# EAGLE design Qwiic PL-N823 IR Breakout (EAGLE 9.4.2)
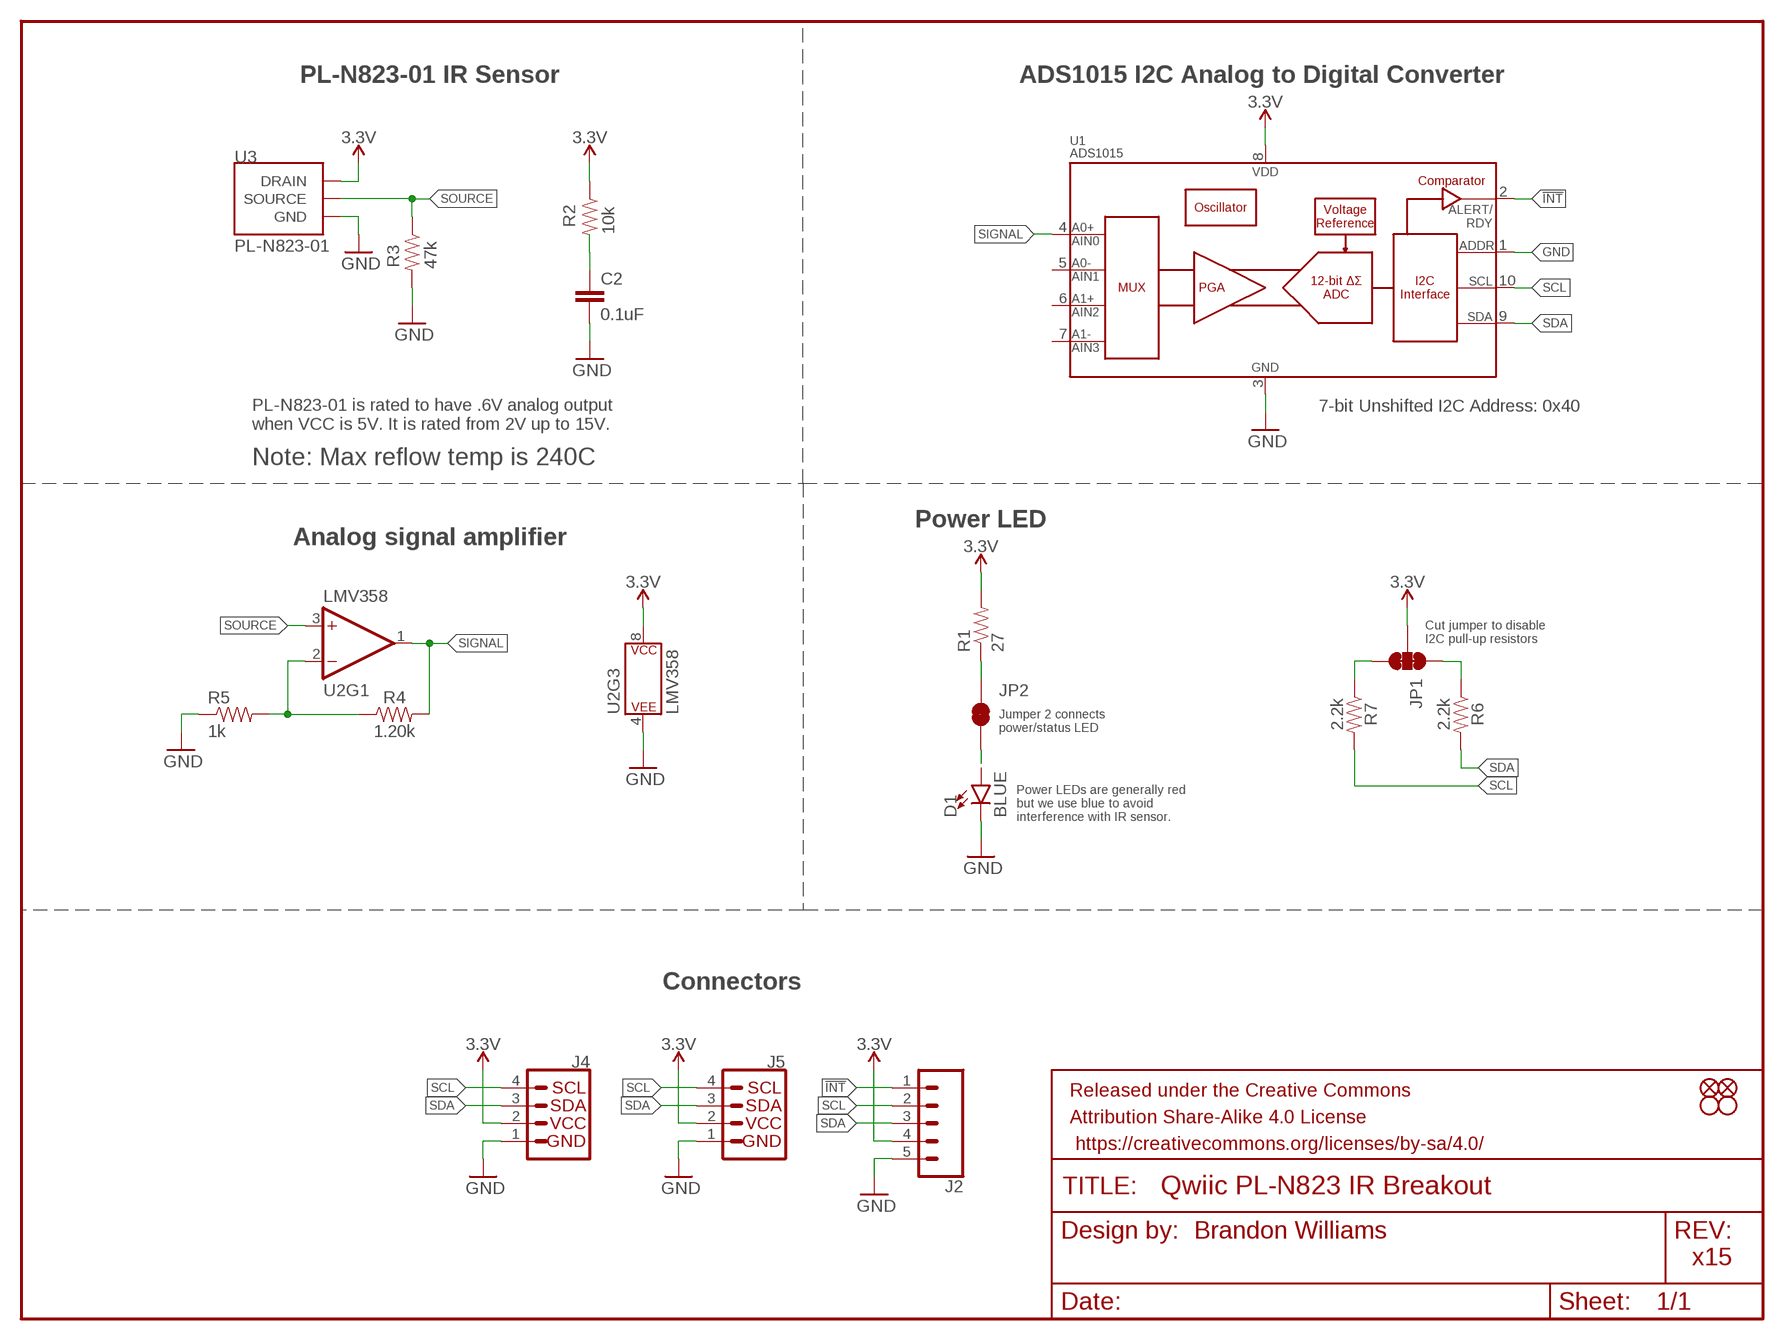
[diagram p0: schematic, sheet 1]

## Parts
C2  0.1uF  0.1UF-0603-25V-(+80/-20%)  [0603]
D1  BLUE  LED-BLUE0603  [LED-0603]
FD1  FIDUCIALUFIDUCIAL  [FIDUCIAL-MICRO]
FD2  FIDUCIALUFIDUCIAL  [FIDUCIAL-MICRO]
FRAME1  FRAME-LETTERNO_PACKAGE  [DUMMY]
H1  STAND-OFFTIGHT  [STAND-OFF-TIGHT]
H2  STAND-OFFTIGHT  [STAND-OFF-TIGHT]
J2  CONN_05NO_SILK  [1X05_NO_SILK]
J4  QWIIC_CONNECTORJS-1MM  [JST04_1MM_RA]
J5  QWIIC_CONNECTORJS-1MM  [JST04_1MM_RA]
JP1  JUMPER-SMT_3_2-NC_TRACE_SILK  [SMT-JUMPER_3_2-NC_TRACE_SILK]
JP2  JUMPER-SMT_2_NC_TRACE_SILK  [SMT-JUMPER_2_NC_TRACE_SILK]
R1  27  27OHM-0603-1/10W-1%  [0603]
R2  10k  10KOHM-0603-1/10W-1%  [0603]
R3  47k  47KOHM-0603-1/10W-1%  [0603]
R4  1.20k  1.20KOHM-0603-1/10W-1%  [0603]
R5  1k  1KOHM-0603-1/10W-1%  [0603]
R6  2.2k  2.2KOHM-0603-1/10W-1%  [0603]
R7  2.2k  2.2KOHM-0603-1/10W-1%  [0603]
U1  ADS1015  [MSOP10]
U2  LMV358  LMV358SOIC  [SO08]
U3  PL-N823-01  [PL-N823-01]

## Nets
3.3V: J2.4 J4.2 J5.2 JP1.2 R1.2 R2.1 U1.8(VDD) U2.8(P$V+) U3.DRAIN
!INT: J2.1 U1.2(ALERT/RDY)
GND: C2.2 D1.C J2.5 J4.1 J5.1 R3.2 R5.1 U1.1(ADDR) U1.3(VSS) U2.4(P$V-) U3.GND@1(GND) U3.GND@2(GND)
N$1: R4.1 R5.2 U2.2(-IN)
N$2: C2.1 R2.2
N$3: JP2.1 R1.1
N$4: JP1.3 R7.1
N$5: JP1.1 R6.1
N$6: D1.A JP2.2
SCL: J2.2 J4.4 J5.4 R7.2 U1.10(SCL)
SDA: J2.3 J4.3 J5.3 R6.2 U1.9(SDA)
SIGNAL: R4.2 U1.4(AIN0) U2.1(OUT)
SOURCE: R3.1 U2.3(+IN) U3.SOURCE
Unconnected: U1.5(AIN1) U1.6(AIN2) U1.7(AIN3) U2.5(+IN) U2.6(-IN) U2.7(OUT)

## Notes on the sheet
- PL-N823-01 IR Sensor | ADS1015 I2C Analog to Digital Converter
- 7-bit Unshifted I2C Address: 0x40
- PL-N823-01 is rated to have .6V analog output
  when VCC is 5V. It is rated from 2V up to 15V.
- Note: Max reflow temp is 240C
- Power LED
- Analog signal amplifier
- Cut jumper to disable
  I2C pull-up resistors
- Jumper 2 connects 
  power/status LED
- Power LEDs are generally red
  but we use blue to avoid
  interference with IR sensor.
- Connectors
- Brandon Williams
- x15

## Library data of the parts
C2 = SparkFun-Capacitors:0.1UF: 0.1µF ceramic capacitors A capacitor is a passive two-terminal electrical component used to store electrical energy temporarily in an electric field.; PROD_ID: CAP-00810
D1 = SparkFun-LED:LED-BLUE: Blue SMD LED Used in manufacturing of various products at SparkFun Packages: 0603 - SMD 0603 package [Product Link] <http://www.digikey.com/product-detail/en/SMLE12BC7TT86/511-1589-2-ND/1641808> 1206 - SMD1206 package [Product Link] <http://www.digikey.com/product-detail/en/lite-on-inc/LTST-C150TBKT/160-1643-1-ND/573584> SparkFun Products: ESP8266 Thing-Dev Board <https://www.sparkfun.com/products/13711> RedBoard <https://www.sparkfun.com/products/12757>; PROD_ID: DIO-08575
FD1 FD2 = SparkFun-Aesthetics:FIDUCIAL: Fiducial Alignment Points Point-of-reference for pick-and-place machines and other optical instruments.
FRAME1 = SparkFun-Aesthetics:FRAME-LETTER: Schematic Frame - Letter Standard 8.5x11 US Letter frame; DESIGNER: Nobody; VERSION: v01
H1 H2 = SparkFun-Hardware:STAND-OFF: Stand Off Drill holes for mechanically mounting via screws, standoffs, etc. Note: Use the keepout ring to avoid running the screw head into surrounding components. Variant Overviews STAND-OFF - Mechanical footprint for a #4 phillips button head screw. STAND-OFF-TIGHT - Mechanical footprint for a #4 phillips button head screw, Example SparkFun Products Screw - Phillips Head (1/4", 4-40, 10 pack) <https://www.sparkfun.com/products/10453> (PRT-10453) Screw - Phillips Head (1/2", 4-40, 10 pack) <https://www.sparkfun.com/products/10452> (PRT-10452) Screw - Phillips Head (3/4", 4-40, 10 pack) <https://www.sparkfun.com/products/10451> (PRT-10451) Screw - Phillips Head (1", 4-40, 10 pack) <https://www.sparkfun.com/products/10450> (PRT-10450)
J2 = SparkFun-Connectors:CONN_05: Multi connection point. Often used as Generic Header-pin footprint for 0.1 inch spaced/style header connections On any of the 0.1 inch spaced packages, you can populate with these: Break Away Headers - Straight <https://www.sparkfun.com/products/116> (PRT-00116) Break Away Male Headers - Right Angle <https://www.sparkfun.com/products/553> (PRT-00553) Female Headers <https://www.sparkfun.com/products/115> (PRT-00115) Break Away Headers - Machine Pin <https://www.sparkfun.com/products/117> (PRT-00117) Break Away Female Headers - Swiss Machine Pin <https://www.sparkfun.com/products/743> (PRT-00743) For SCREWTERMINALS and SPRING TERMINALS visit here: Screw Terimnals on SparkFun.com <https://www.sparkfun.com/search/results?term=Screw+Terminals> (5mm/3.5mm/2.54mm spacing) This device is also useful as a general connection point to wire up your design to another part of your project. Our various solder wires solder well into these plated through hole pads. Hook-Up Wire - Assortment (Stranded, 22 AWG) <https://www.sparkfun.com/products/11375> (PRT-11375) Hook-Up Wire - Assortment (Solid Core, 22 AWG) <https://www.sparkfun.com/products/11367> (PRT-11367) View the entire wire category on our website here <https://www.sparkfun.com/categories/141> Special notes: Molex polarized connector foot print use with SKU : PRT-08231 with associated crimp pins and housings. 1MM SMD Version SKU: PRT-10208
J4 J5 = SparkFun-Connectors:QWIIC_CONNECTOR: SparkFun I2C Standard Qwiic Connector An SMD 1mm pitch JST connector makes it easy and quick (get it? Qwiic?) to connect I2C devices to each other. The Qwiic system <http://www.sparkfun.com/qwiic> enables fast and solderless connection between popular platforms and various sensors and actuators. We carry 200mm <https://www.sparkfun.com/products/14204>, 100mm <https://www.sparkfun.com/products/14205>, 50mm <https://www.sparkfun.com/products/14206>, and breadboard friendly <https://www.sparkfun.com/products/14207> Qwiic cables. We also offer 10 pcs strips <https://www.sparkfun.com/products/14323> the SMD connectors.; PROD_ID: CONN-13694
JP1 = SparkFun-Jumpers:JUMPER-SMT_3_2-NC_TRACE: Normally closed trace jumper (2 of 2 connections) This jumper has a trace between all three pads so they are normally closed (NC). Use a razor knife to open the connection(s). For best results follow the IPC guidelines for cutting traces: Cutout at least 0.063 mm (0.005 in). Remove all loose material to clean up the cut area. Seal the cut with an approved epoxy. Reapply solder to reclose the connection(s).
JP2 = SparkFun-Jumpers:JUMPER-SMT_2_NC_TRACE: Normally closed trace jumper This jumper has a trace between two pads so it's normally closed (NC). Use a razor knife to open the connection. For best results follow the IPC guidelines for cutting traces: Cutout at least 0.063 mm (0.005 in). Remove all loose material to clean up the cut area. Seal the cut with an approved epoxy. Reapply solder to reclose the connection.
R1 = SparkFun-Resistors:27OHM: 27Ω resistor A resistor is a passive two-terminal electrical component that implements electrical resistance as a circuit element. Resistors act to reduce current flow, and, at the same time, act to lower voltage levels within circuits. - Wikipedia; PROD_ID: RES-09334
R2 = SparkFun-Resistors:10KOHM: 10kΩ resistor A resistor is a passive two-terminal electrical component that implements electrical resistance as a circuit element. Resistors act to reduce current flow, and, at the same time, act to lower voltage levels within circuits. - Wikipedia; PROD_ID: RES-00824
R3 = SparkFun-Resistors:47KOHM: 47kΩ resistor A resistor is a passive two-terminal electrical component that implements electrical resistance as a circuit element. Resistors act to reduce current flow, and, at the same time, act to lower voltage levels within circuits. - Wikipedia; PROD_ID: RES-07871
R4 = SparkFun-Resistors:1.20KOHM: 1.20kΩ resistor A resistor is a passive two-terminal electrical component that implements electrical resistance as a circuit element. Resistors act to reduce current flow, and, at the same time, act to lower voltage levels within circuits. - Wikipedia; PROD_ID: RES-08413
R5 = SparkFun-Resistors:1KOHM: 1kΩ resistor A resistor is a passive two-terminal electrical component that implements electrical resistance as a circuit element. Resistors act to reduce current flow, and, at the same time, act to lower voltage levels within circuits. - Wikipedia; PROD_ID: RES-07856
R6 R7 = SparkFun-Resistors:2.2KOHM: 2.2kΩ resistor A resistor is a passive two-terminal electrical component that implements electrical resistance as a circuit element. Resistors act to reduce current flow, and, at the same time, act to lower voltage levels within circuits. - Wikipedia; PROD_ID: RES-08272
U1 = SparkFun-IC-Conversion:ADS1015: ADS1015 12-BIT ADC 12-Bit Del-Sig ADC Four single-ended inputs or two differential inputs Internal PGA I2C interface 2.0-5.5V SparkFun Products SparkFun Block for Intel Edison - ADC <https://www.sparkfun.com/products/13770> (DEV-13770); PROD_ID: IC-12270
U2 = SparkFun-IC-Amplifiers:LMV358: IC LMV358 DUAL OP AMP Jellybean rail-to-rail output op-amp SparkFun Products SparkFun PicoBoard <https://www.sparkfun.com/products/11888> (WIG-11888) SparkFun Vernier Interface Shield <https://www.sparkfun.com/products/12858> (DEV-12858) SparkFun Blynk Board - ESP8266 <https://www.sparkfun.com/products/13794> (WRL-13794) SparkFun Digital Sandbox <https://www.sparkfun.com/products/12651> (DEV-12651 RoHS); PROD_ID: IC-09657
U3 = PL-N823-01:PL-N823-01: Lensless passive infrared sensor from Kemet Electronics; PROD_ID: IC-14725

## Net classes
1 power: width 0.305 mm

## Board
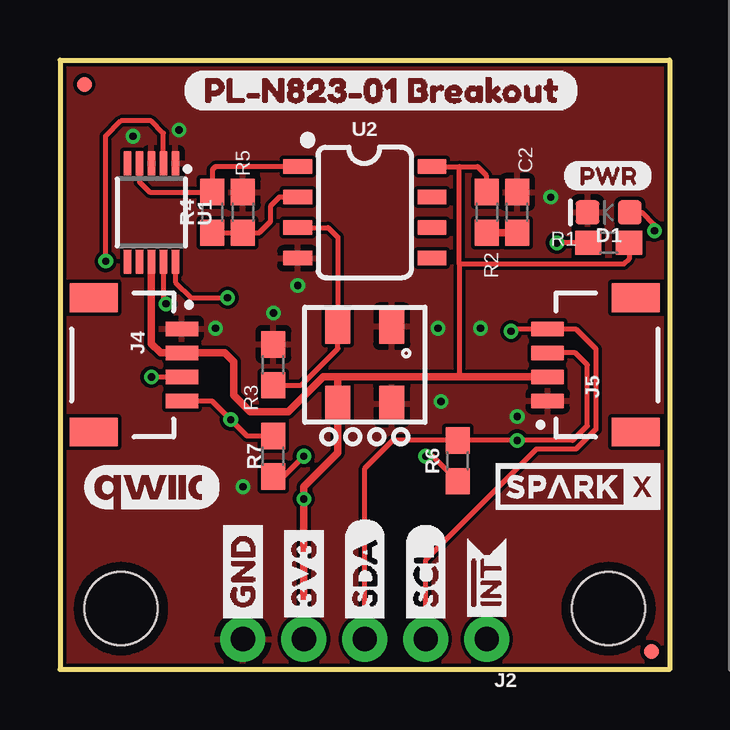
[diagram p1: board, top side]
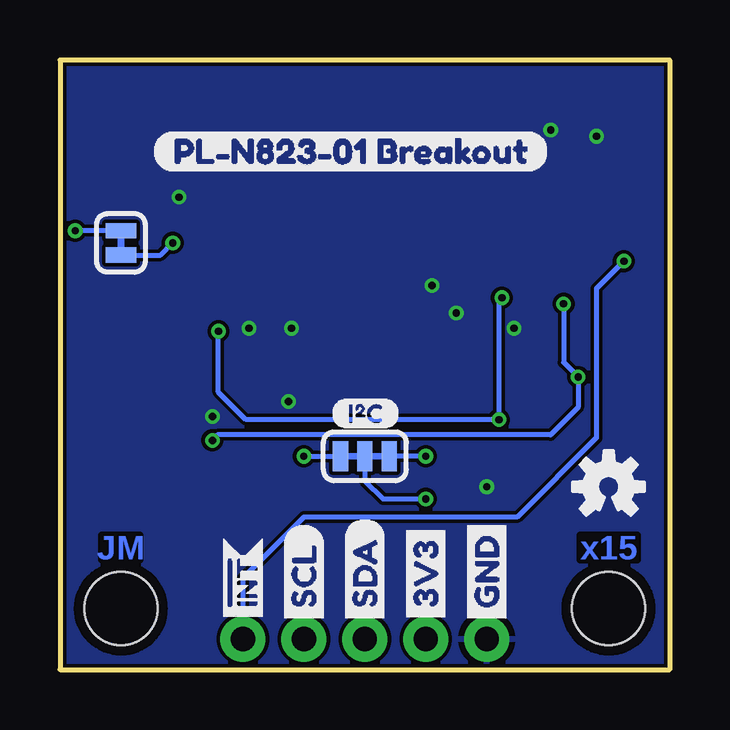
[diagram p2: board, bottom side, seen from below]

Size 25.4 x 25.4 mm. Coordinates in mm from the lower left corner, seen from the top.
Outline: 0,25.4 25.4,25.4 25.4,0 0,0 0,25.4
Copper layers (1*16): Top 0.035mm / dielectric 1.5mm / Bottom 0.035mm
Design rules "SparkFun-2-layer-PCBWay-LIMIT": minimum track width 6mil, minimum drill 0.3mm, track to track 6mil, track to pad 6mil, pad to pad 6mil, via to via 6mil, smd to smd 6mil, copper to edge 6mil, drill to drill 6mil, minimum pad ring 6mil, minimum via ring 6mil, stop-mask expansion 4mil, vias tented up to drill 25mil, thermal gap 10mil

### Footprints (pad centres in the part's own frame; a part is rotated, then mirrored left to right if it is on the bottom)
0603 = smd 1.1 x 1: 1 -0.85,0; 2 0.85,0
LED-0603 = smd 1 x 1: A -0.877,0; C 0.877,0
FIDUCIAL-MICRO = smd 0.635 x 0.635: 1 0,0
STAND-OFF-TIGHT = hole 3.048: 0,0
1X05_NO_SILK = drill 1.016 pad 1.88: 1 0,0; 2 2.54,0; 3 5.08,0; 4 7.62,0; 5 10.16,0
JST04_1MM_RA = smd 0.6 x 1.35: 1 -1.5,0; 2 -0.5,0; 3 0.5,0; 4 1.5,0 | smd 1.2 x 2: NC1 2.8,-3.675; NC2 -2.8,-3.675
SMT-JUMPER_3_2-NC_TRACE_SILK = smd 0.635 x 1.27: 1 -1.016,0; 2 0,0; 3 1.016,0
SMT-JUMPER_2_NC_TRACE_SILK = smd 0.635 x 1.27: 1 -0.508,0; 2 0.508,0
MSOP10 = smd 0.3 x 1: 1 -1,-2.05; 2 -0.5,-2.05; 3 0,-2.05; 4 0.5,-2.05; 5 1,-2.05; 6 1,2.05; 7 0.5,2.05; 8 0,2.05; 9 -0.5,2.05; 10 -1,2.05
SO08 = smd 0.6 x 1.2: 1 -1.905,-2.8; 2 -0.635,-2.8; 3 0.635,-2.8; 4 1.905,-2.8; 5 1.905,2.8; 6 0.635,2.8; 7 -0.635,2.8; 8 -1.905,2.8
PL-N823-01 = smd 1.05 x 1.475: DRAIN -1.125,-1.613; GND@1 1.125,1.613; GND@2 1.125,-1.613; SOURCE -1.125,1.613

### Placement (x,y rotation side)
C2  19.05,19.05 90 top
D1  22.86,19.05 180 top
FD1  1.02,24.38 0 top
FD2  24.64,0.76 0 top
FRAME1  0,0 0 top
H1  2.54,2.54 0 top
H2  22.86,2.54 0 top
J2  17.78,1.27 180 top
J4  5.08,12.7 270 top
J5  20.32,12.7 90 top
JP1  12.7,8.89 0 bottom
JP2  22.86,17.78 90 bottom
R1  22.86,17.78 0 top
R2  17.78,19.05 270 top
R3  8.89,12.7 90 top
R4  6.35,19.05 90 top
R5  7.62,19.05 270 top
R6  16.57,8.7 90 top
R7  8.89,8.89 90 top
U1  3.81,19.05 180 top
U2  12.7,19.05 270 top
U3  12.7,12.7 0 top
U$1  [QWIIC_COPYRIGHT_SMALL]  3.81,7.62 0 top
U$2  [SDA-[)]  12.7,1.65 90 top
U$3  [PRODUCTION_INSTRUCTIONS]  27.94,50.8 0 top  (outside the outline)
U$4  [PL#N823#01_BREAKOUT0]  21.59,21.59 0 bottom
U$5  [I_SUPER2_C-()-03]  14.1,10.67 0 bottom
U$6  [INT#-[<-04]  17.78,1.52 90 top
U$7  [OSHW-LOGO-S]  2.54,7.62 0 bottom
U$8  [PL#N823#01_BREAKOUT0]  5.08,24.13 0 top
U$9  [PWR-()-03]  20.95,20.57 0 top
U$10  [SPARKX-SMALL]  21.59,7.62 0 top
U$11  [INT#-[<-04]  17.78,1.52 90 bottom
U$12  [SCL-[)]  15.24,1.65 90 top
U$13  [SDA-[)]  12.7,1.65 90 bottom
U$14  [SCL-[)]  15.24,1.65 90 bottom
U$15  [3V3-04]  10.16,1.65 90 top
U$16  [3V3-04]  10.16,1.65 90 bottom
U$17  [GND-04]  7.62,1.65 90 top
U$18  [GND-04]  7.62,1.65 90 bottom

### Tracks (layer width: path | path; a pad name or v marks a point on that pad's centre or on a via)
3.3V  (via drill 0.3)
  Top 0.203: R1.2 23.71,17.11 23.5,16.89 16.64,16.89 | 16.64,16.89 16.64,12.2 | U2.8 16.64,20.95 | 16.64,20.95 17.4,20.95 17.78,20.57 R2.1 | 16.64,16.89 16.64,20.95
  Top 0.305: J5.2 16.64,12.2 11.56,12.2 | 11.56,12.2 10.97,12.2 9.52,10.74 7.93,10.74 7.24,11.43 7.24,12.83 6.87,13.2 J4.2 4.19,13.2 3.81,13.58 U1.8 | 11.56,12.2 11.57,12.18 U3.DRAIN 11.57,9.04 10.16,7.62 v10.16,7.11 J2.4
  Bottom 0.203: JP1.2 12.7,7.87 11.94,7.11 v10.16,7.11
!INT  (via drill 0.3)
  Top 0.203: U1.2 4.31,22.35 3.8,22.86 2.54,22.86 1.91,22.23 v1.91,17.02
  Bottom 0.203: v1.91,17.02 3.05,15.88 3.05,9.65 6.35,6.35 15.24,6.35 17.78,3.81 J2.1
GND  (via drill 0.3)
  other vias: 15.88,11.18 15.75,14.22 9.91,16 4.95,22.48 3.05,22.23 6.48,14.22 8.89,14.86 19.05,10.54 20.45,19.68 7.62,7.62 17.53,14.22
  pour Top: 0,25.4 0,0 25.4,0 25.4,25.4
  pour Bottom: 0,0 0,25.4 25.4,25.4 25.4,0
N$1
  Top 0.203: U2.2 9.14,19.68 8.76,19.3 8.76,18.67 8.29,18.2 R5.2 R4.1
N$2
  Top 0.305: R2.2 C2.1
N$3  (via drill 0.3)
  Top 0.203: R1.1 v20.7,17.78
  Bottom 0.203: JP2.1 21.21,17.27 v20.7,17.78
N$4  (via drill 0.3)
  Top 0.203: R7.1 9.31,8.04 v10.16,8.89
  Bottom 0.203: v10.16,8.89 JP1.3
N$5  (via drill 0.3)
  Top 0.203: R6.1 15.53,8.89 v15.24,8.89
  Bottom 0.203: v15.24,8.89 JP1.1
N$6  (via drill 0.3)
  Top 0.203: D1.A 24.26,19.05 24.77,18.54 v24.77,18.29
  Bottom 0.203: JP2.2 v24.77,18.29
SCL  (via drill 0.3)
  Top 0.203: J4.4 6.33,11.2 v7.11,10.41 7.79,9.74 R7.2 | U1.10 4.81,16.14 5.46,15.49 v6.99,15.49 | v18.8,14.1 18.9,14.2 J5.4 21.49,14.2 22.33,13.36 22.33,10.01 21.51,9.19 19.86,9.19 15.24,4.57 J2.2
  Bottom 0.203: v6.99,15.49 7.11,15.37 v7.11,10.41 17.65,10.41 18.8,11.56 v18.8,14.1
SDA  (via drill 0.3)
  Top 0.203: J5.3 21.47,13.2 21.97,12.7 21.97,10.16 21.36,9.55 v19.05,9.55 R6.2 13.87,9.55 12.7,8.38 J2.3 | v4.42,15.24 4.31,15.35 U1.9 | v3.81,12.19 v3.82,12.2 J4.3
  Bottom 0.203: v4.42,15.24 4.42,12.8 v3.81,12.19 3.81,10.92 4.95,9.78 18.84,9.78 19.05,9.57 v19.05,9.55
SIGNAL
  Top 0.203: U2.1 6.48,20.95 6.35,20.83 R4.2 3.73,19.9 3.31,20.32 U1.4
SOURCE
  Top 0.203: U2.3 11.18,18.41 11.57,18.02 U3.SOURCE 11.57,13.38 10.05,11.85 R3.1

### Text on the board
Bottom: x15 | JM
tDocu: Max reflow temp is 240C | No clean